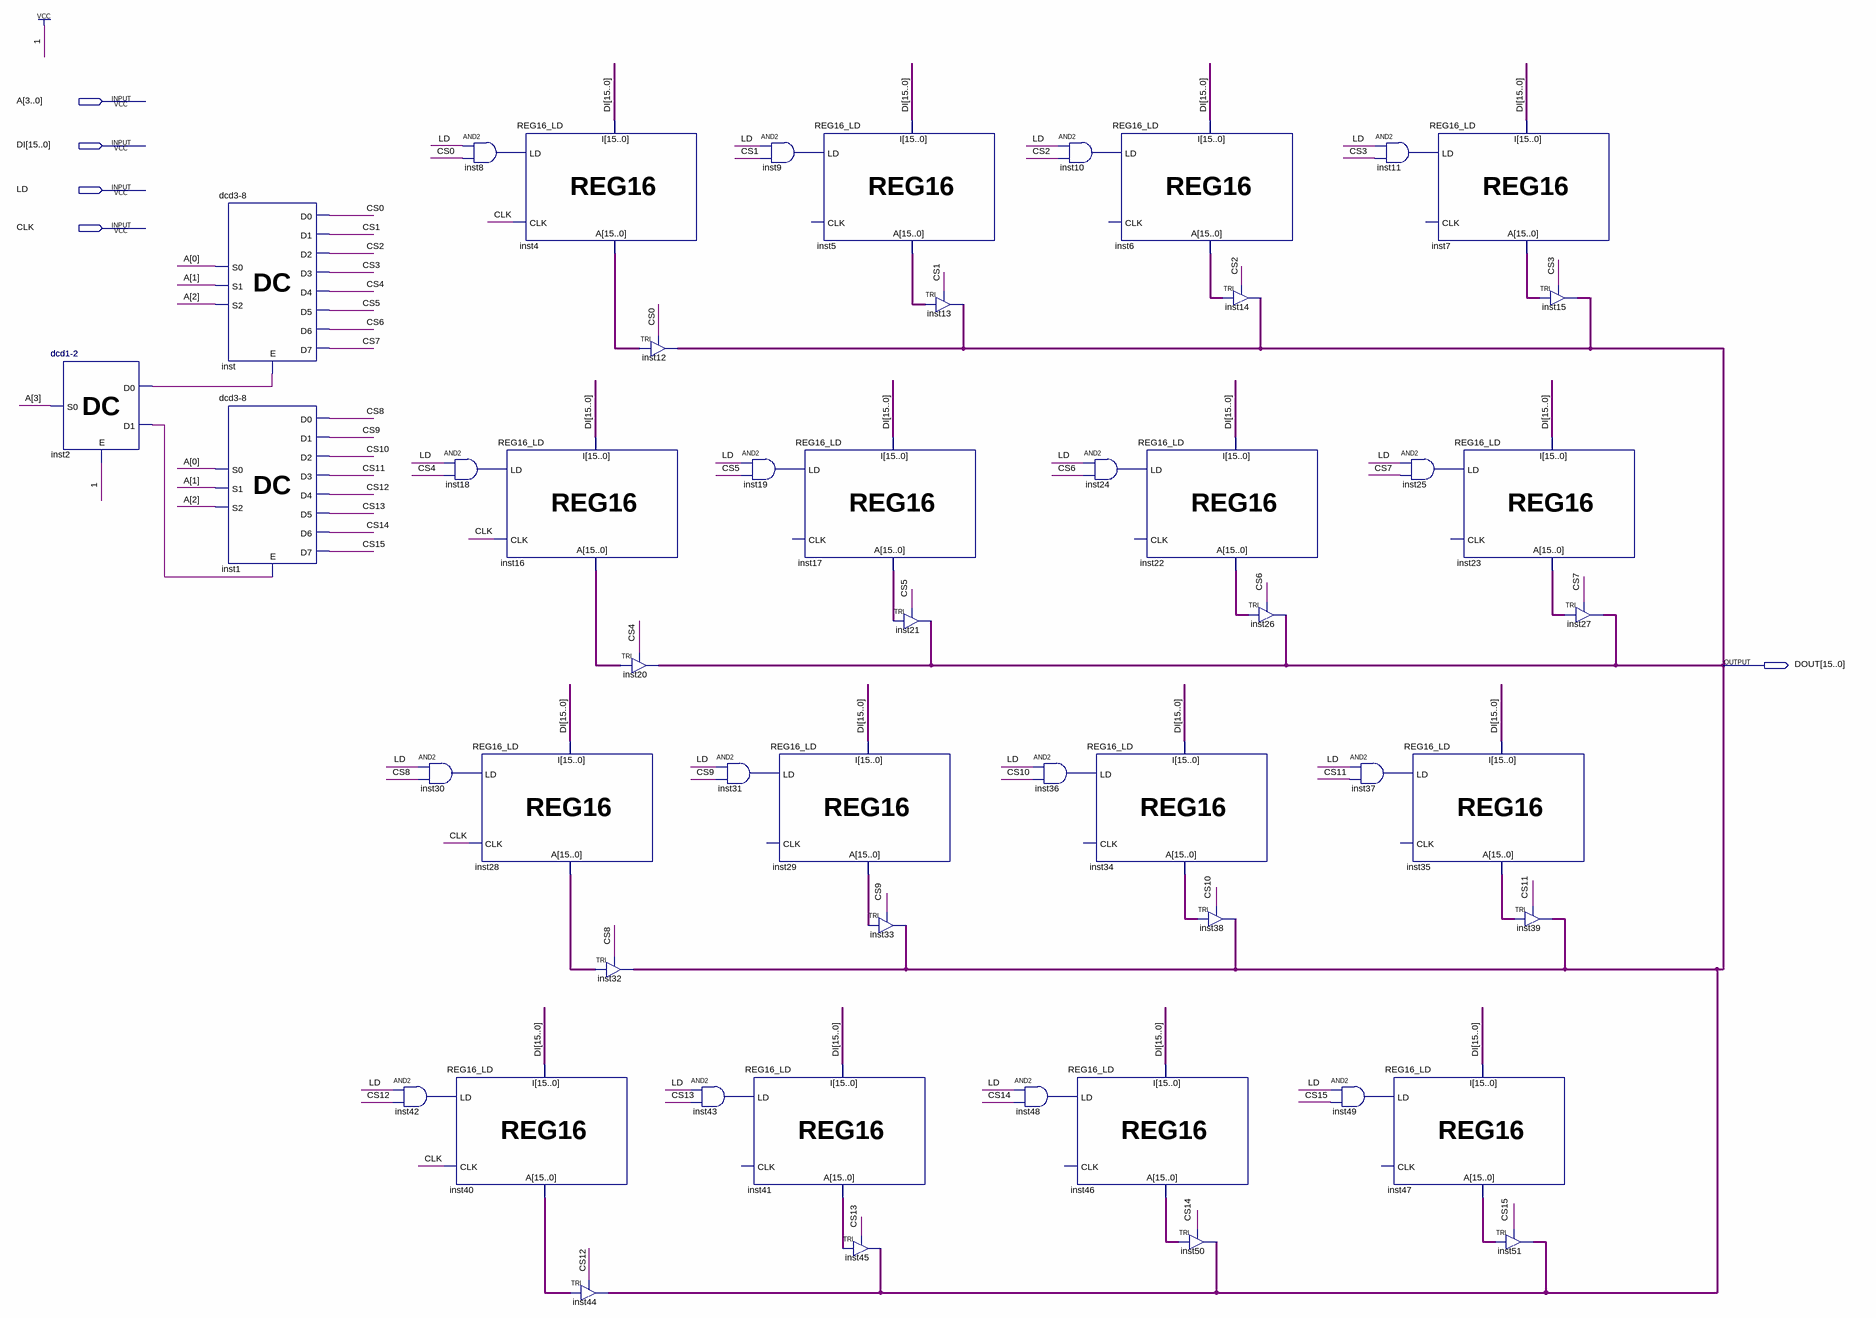
[diagram p0: schematic sheet]
// Quartus schematic GPR.bdf as structural Verilog: 51 symbols, 5 pins
module GPR (
  input  [3:0] A,
  input  [15:0] DI,
  input  LD,
  input  CLK,
  output [15:0] DOUT
);

  wire CS0, CS1, CS2, CS3, CS4, CS5, CS6, CS7, CS8, CS9, CS10, CS11, CS12, CS13, CS14, CS15, inst2_d0,
       inst2_d1, inst8_out, inst9_out, inst10_out, inst11_out, inst18_out, inst19_out, inst24_out,
       inst25_out, inst30_out, inst31_out, inst36_out, inst37_out, inst42_out, inst43_out, inst48_out,
       inst49_out;
  wire [15:0] inst4_a, inst5_a, inst6_a, inst7_a, inst16_a, inst17_a, inst22_a, inst23_a, inst28_a, inst29_a,
       inst34_a, inst35_a, inst40_a, inst41_a, inst46_a, inst47_a;

  \dcd1-2  inst2 (.E(1'b1), .S0(A[3]), .D0(inst2_d0), .D1(inst2_d1));
  \dcd3-8  inst (
    .E(inst2_d0), .S0(A[0]), .S1(A[1]), .S2(A[2]), .D0(CS0), .D1(CS1), .D2(CS2), .D3(CS3), .D4(CS4),
    .D5(CS5), .D6(CS6), .D7(CS7));
  \dcd3-8  inst1 (
    .E(inst2_d1), .S0(A[0]), .S1(A[1]), .S2(A[2]), .D0(CS8), .D1(CS9), .D2(CS10), .D3(CS11), .D4(CS12),
    .D5(CS13), .D6(CS14), .D7(CS15));
  and inst42 (inst42_out, LD, CS12);
  and inst18 (inst18_out, LD, CS4);
  and inst30 (inst30_out, LD, CS8);
  REG16_LD inst40 (.I(DI), .CLK(CLK), .LD(inst42_out), .A(inst40_a));
  and inst8 (inst8_out, LD, CS0);
  REG16_LD inst16 (.I(DI), .CLK(CLK), .LD(inst18_out), .A(inst16_a));
  REG16_LD inst28 (.I(DI), .CLK(CLK), .LD(inst30_out), .A(inst28_a));
  REG16_LD inst4 (.I(DI), .CLK(CLK), .LD(inst8_out), .A(inst4_a));
  TRI inst32[15:0] (.IN(inst28_a), .OE(CS8), .OUT(DOUT));
  TRI inst44[15:0] (.IN(inst40_a), .OE(CS12), .OUT(DOUT));
  TRI inst12[15:0] (.IN(inst4_a), .OE(CS0), .OUT(DOUT));
  TRI inst20[15:0] (.IN(inst16_a), .OE(CS4), .OUT(DOUT));
  and inst43 (inst43_out, LD, CS13);
  and inst19 (inst19_out, LD, CS5);
  and inst31 (inst31_out, LD, CS9);
  REG16_LD inst41 (.I(DI), .LD(inst43_out), .A(inst41_a));  // open: CLK
  and inst9 (inst9_out, LD, CS1);
  REG16_LD inst17 (.I(DI), .LD(inst19_out), .A(inst17_a));  // open: CLK
  REG16_LD inst29 (.I(DI), .LD(inst31_out), .A(inst29_a));  // open: CLK
  REG16_LD inst5 (.I(DI), .LD(inst9_out), .A(inst5_a));  // open: CLK
  TRI inst45[15:0] (.IN(inst41_a), .OE(CS13), .OUT(DOUT));
  TRI inst21[15:0] (.IN(inst17_a), .OE(CS5), .OUT(DOUT));
  TRI inst33[15:0] (.IN(inst29_a), .OE(CS9), .OUT(DOUT));
  TRI inst13[15:0] (.IN(inst5_a), .OE(CS1), .OUT(DOUT));
  and inst10 (inst10_out, LD, CS2);
  and inst36 (inst36_out, LD, CS10);
  and inst48 (inst48_out, LD, CS14);
  REG16_LD inst6 (.I(DI), .LD(inst10_out), .A(inst6_a));  // open: CLK
  and inst24 (inst24_out, LD, CS6);
  REG16_LD inst34 (.I(DI), .LD(inst36_out), .A(inst34_a));  // open: CLK
  REG16_LD inst46 (.I(DI), .LD(inst48_out), .A(inst46_a));  // open: CLK
  REG16_LD inst22 (.I(DI), .LD(inst24_out), .A(inst22_a));  // open: CLK
  TRI inst38[15:0] (.IN(inst34_a), .OE(CS10), .OUT(DOUT));
  TRI inst50[15:0] (.IN(inst46_a), .OE(CS14), .OUT(DOUT));
  TRI inst14[15:0] (.IN(inst6_a), .OE(CS2), .OUT(DOUT));
  TRI inst26[15:0] (.IN(inst22_a), .OE(CS6), .OUT(DOUT));
  and inst37 (inst37_out, LD, CS11);
  and inst49 (inst49_out, LD, CS15);
  and inst11 (inst11_out, LD, CS3);
  and inst25 (inst25_out, LD, CS7);
  REG16_LD inst35 (.I(DI), .LD(inst37_out), .A(inst35_a));  // open: CLK
  REG16_LD inst47 (.I(DI), .LD(inst49_out), .A(inst47_a));  // open: CLK
  REG16_LD inst7 (.I(DI), .LD(inst11_out), .A(inst7_a));  // open: CLK
  REG16_LD inst23 (.I(DI), .LD(inst25_out), .A(inst23_a));  // open: CLK
  TRI inst39[15:0] (.IN(inst35_a), .OE(CS11), .OUT(DOUT));
  TRI inst51[15:0] (.IN(inst47_a), .OE(CS15), .OUT(DOUT));
  TRI inst15[15:0] (.IN(inst7_a), .OE(CS3), .OUT(DOUT));
  TRI inst27[15:0] (.IN(inst23_a), .OE(CS7), .OUT(DOUT));
endmodule
